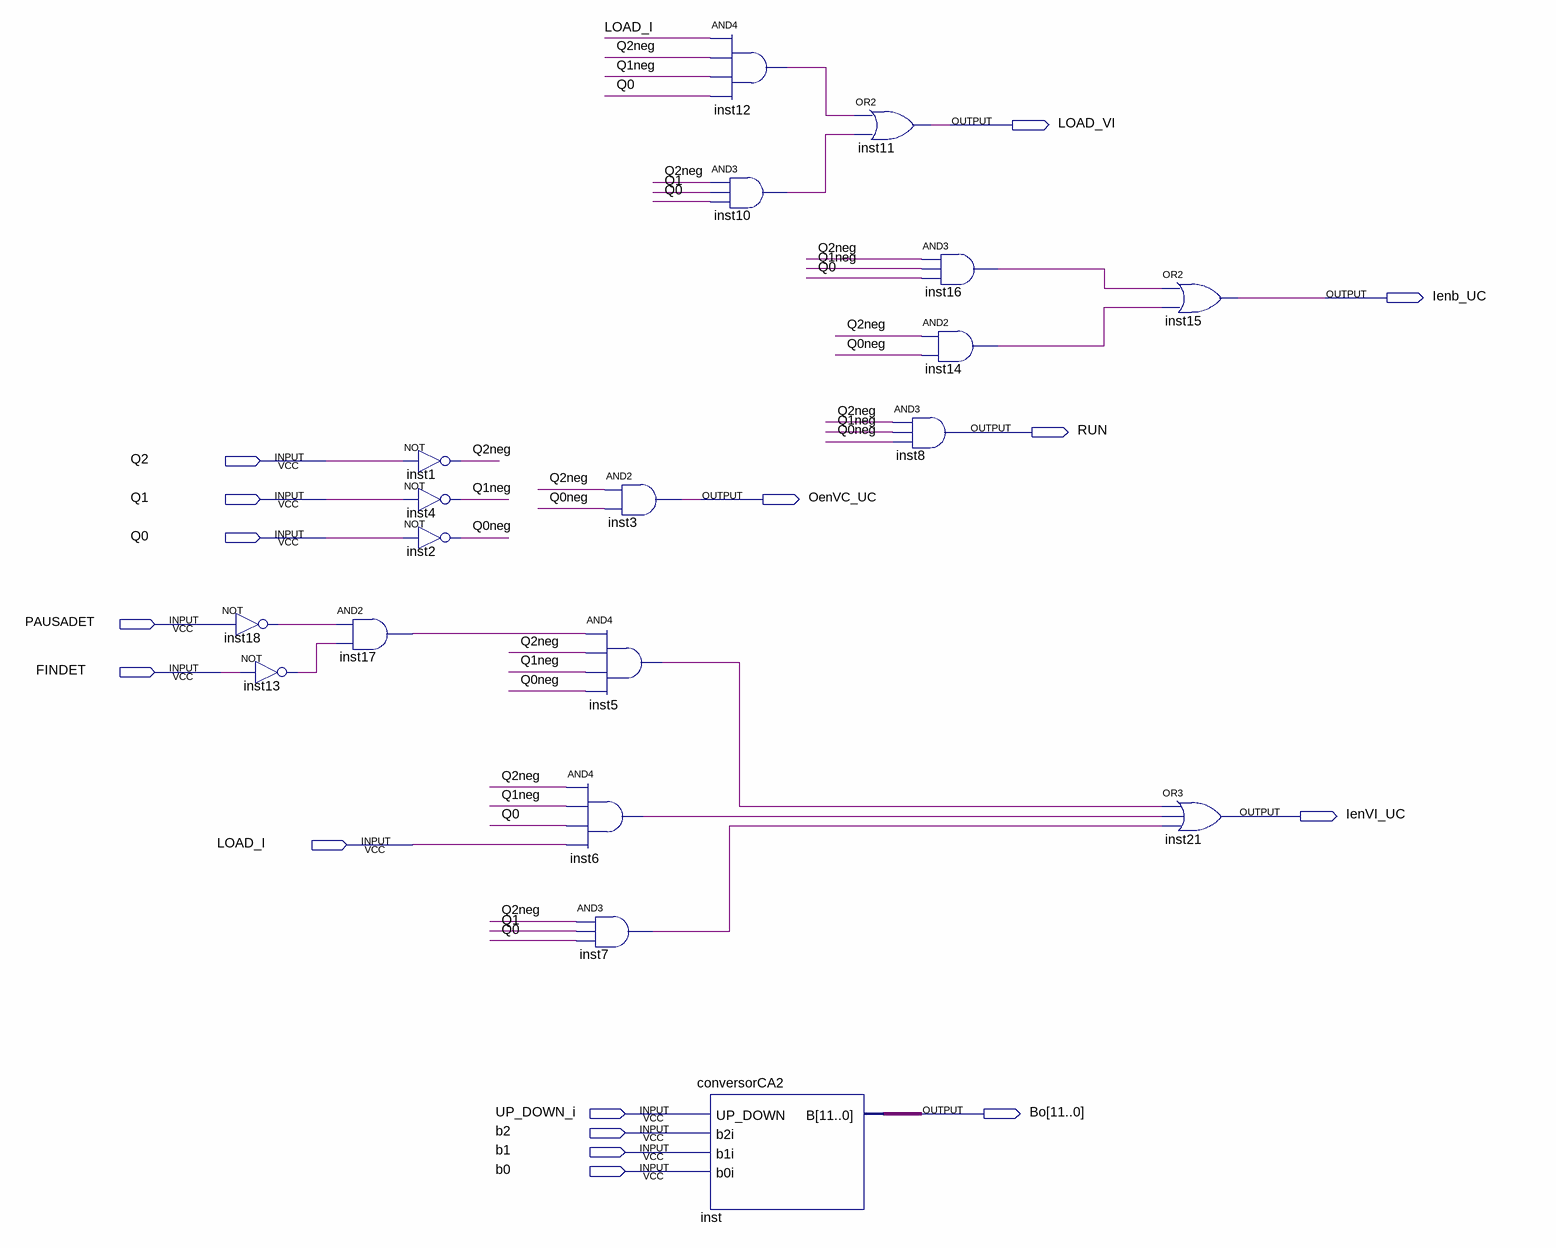
[diagram p0: schematic sheet]
// Quartus schematic UC_de_UC.bdf as structural Verilog: 19 symbols, 16 pins
module UC_de_UC (
  input  Q2,
  input  Q1,
  input  Q0,
  input  PAUSADET,
  input  FINDET,
  input  LOAD_I,
  input  UP_DOWN_i,
  input  b2,
  input  b1,
  input  b0,
  output LOAD_VI,
  output Ienb_UC,
  output RUN,
  output OenVC_UC,
  output IenVI_UC,
  output [11:0] Bo
);

  wire inst5_out, inst6_out, inst7_out, inst10_out, inst12_out, inst13_out, inst14_out, inst16_out,
       inst17_out, inst18_out, Q0neg, Q1neg, Q2neg;

  not inst18 (inst18_out, PAUSADET);
  not inst13 (inst13_out, FINDET);
  and inst17 (inst17_out, inst18_out, inst13_out);
  not inst1 (Q2neg, Q2);
  not inst4 (Q1neg, Q1);
  not inst2 (Q0neg, Q0);
  and inst5 (inst5_out, inst17_out, Q2neg, Q1neg, Q0neg);
  and inst6 (inst6_out, Q2neg, Q1neg, Q0, LOAD_I);
  and inst7 (inst7_out, Q2neg, Q1, Q0);
  and inst3 (OenVC_UC, Q2neg, Q0neg);
  and inst12 (inst12_out, LOAD_I, Q2neg, Q1neg, Q0);
  and inst10 (inst10_out, Q2neg, Q1, Q0);
  conversorCA2 inst (.UP_DOWN(UP_DOWN_i), .b2i(b2), .b1i(b1), .b0i(b0), .B(Bo));
  or inst11 (LOAD_VI, inst12_out, inst10_out);
  and inst8 (RUN, Q2neg, Q1neg, Q0neg);
  and inst16 (inst16_out, Q2neg, Q1neg, Q0);
  and inst14 (inst14_out, Q2neg, Q0neg);
  or inst15 (Ienb_UC, inst16_out, inst14_out);
  or inst21 (IenVI_UC, inst5_out, inst6_out, inst7_out);
endmodule
